# Altium schematic sheet Top Nordic.SchDoc: Top Nordic
size B; CompanyName: Rigado, LLC; SheetNumber: 1; Website: www.rigado.com; SheetSize: B
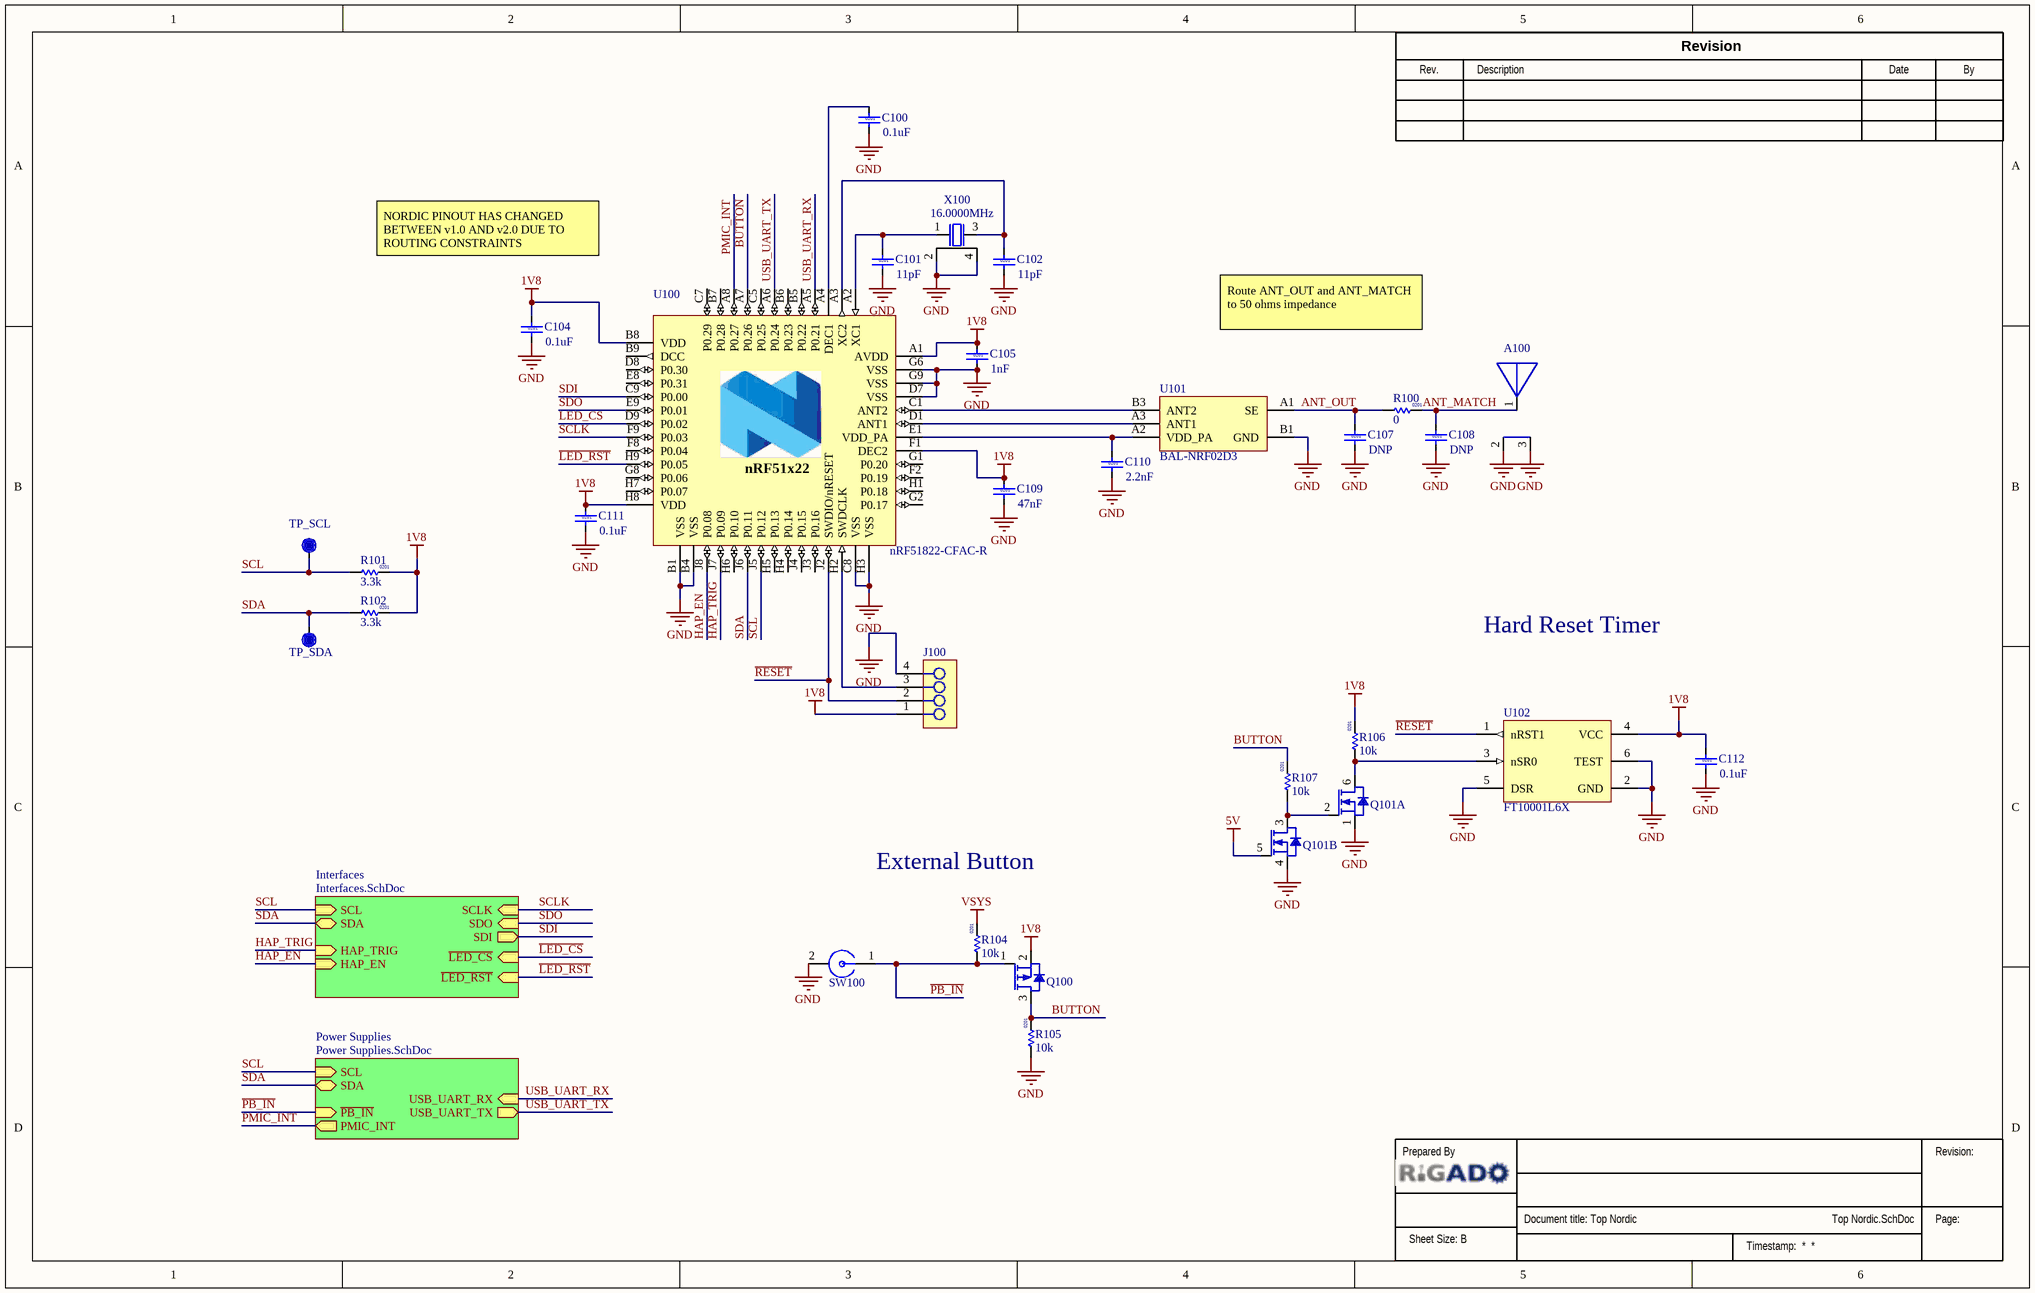
[diagram p0: Top Nordic.SchDoc]

## Parts
(Parts that share a designator on the sheet are numbered #1, #2 ... from top to bottom, then left to right.)
?#1  (no value)  (graphical)
?#2  (no value)  (graphical)
A100  2450AT07A0100  [2450AT07A0100]  (value not drawn)
C100  value 0.1uF  Size: 0201  [Cap 0201 HD]  (hidden comment: Cap 0201 0.1uF 6.3V0.1uF)
C101  value 11pF  Size: 0201  [Cap 0201 HD]  (hidden comment: Cap 0201 11pF 25V11pF)
C102  value 11pF  Size: 0201  [Cap 0201 HD]  (hidden comment: Cap 0201 11pF 25V11pF)
C104  value 0.1uF  Size: 0201  [Cap 0201 HD]  (hidden comment: Cap 0201 0.1uF 6.3V0.1uF)
C105  value 1nF  Size: 0201  [Cap 0201 HD]  (hidden comment: Cap 0201 1nF 25V1nF)
C107  value DNP  Size: 0201  [Cap 0201 HD]  (hidden comment: Cap 0201 GenericDNPDNP)
C108  value DNP  Size: 0201  [Cap 0201 HD]  (hidden comment: Cap 0201 GenericDNPDNP)
C109  value 47nF  Size: 0201  [Cap 0201 HD]  (hidden comment: Cap 0201 47nF 10V47nF)
C110  value 2.2nF  Size: 0201  [Cap 0201 HD]  (hidden comment: Cap 0201 2.2nF 16V2.2nF)
C111  value 0.1uF  Size: 0201  [Cap 0201 HD]  (hidden comment: Cap 0201 0.1uF 6.3V0.1uF)
C112  value 0.1uF  Size: 0201  [Cap 0201 HD]  (hidden comment: Cap 0201 0.1uF 6.3V0.1uF)
J100  SWD_Pogo_TPDNP  [TP10R_1.27P-4Pin]  (value not drawn)
Q100  RZM001P02  [SOT-723]  (value not drawn)
Q101  Si1902CDL  [SC70-6]  (value not drawn)  (parts A,B of 2)
R100  value 0  Size: 0201  [RES 0201 HD]  (hidden comment: Res 0201 0R Jumper0)
R101  value 3.3k  Size: 0201  [RES 0201 HD]  (hidden comment: Res 0201 3.3k 5%3.3k)
R102  value 3.3k  Size: 0201  [RES 0201 HD]  (hidden comment: Res 0201 3.3k 5%3.3k)
R104  value 10k  Size: 0201  [RES 0201 HD]  (hidden comment: Res 0201 10k 5%10k)
R105  value 10k  Size: 0201  [RES 0201 HD]  (hidden comment: Res 0201 10k 5%10k)
R106  value 10k  Size: 0201  [RES 0201 HD]  (hidden comment: Res 0201 10k 5%10k)
R107  value 10k  Size: 0201  [RES 0201 HD]  (hidden comment: Res 0201 10k 5%10k)
SW100  GX05170  [GX05170]  (value not drawn)
TP_SCL  TP  [TP10R]  (value not drawn)
TP_SDA  TP  [TP10R]  (value not drawn)
U100  Manufacturer P/N: nRF51822-CFAC-R  [CFAC_WLCSP]
U101  BAL-NRF02D3  [BGA0.4P2x3-5Pin]
U102  FT10001L6X  [DFN0.5P-6Pin]
X100  Frequency: 16.0000MHz  [XTAL_2016]

## Sub-sheets
Interfaces = Interfaces.SchDoc: SDA (bidir), SCL (in), SDO (in), ~{LED_CS} (in), ~{LED_RST} (in), SCLK (in), HAP_EN (in), HAP_TRIG (in), SDI (out)
Power Supplies = Power Supplies.SchDoc: SCL (in), SDA (bidir), PMIC_INT (out), ~{PB_IN} (in), USB_UART_RX (in), USB_UART_TX (out)

## Nets
1V8: C104.1 C105.1 C109.1 C111.1 C112.1 J100.1 Q100.2(S) R101.2 R102.2 R106.2 U100.A1(AVDD) U100.B8(VDD) U100.F1(DEC2) U100.H8(VDD) U102.4(VCC)
5V: Q101.5(G2)
GND: A100.2 A100.3 C100.2 C101.2 C102.2 C104.2 C105.2 C107.2 C108.2 C109.2 C110.2 C111.2 C112.2 J100.4 Q101.1(S1) Q101.4(S2) R105.1 SW100.2 U100.B1(VSS) U100.B4(VSS) U100.C8(VSS) U100.D7(VSS) U100.G3(N.C.) U100.G4(N.C.) U100.G6(VSS) U100.G9(VSS) U100.H3(VSS) U101.B1(GND) U102.2(GND) U102.5(DSR) U102.6(TEST) X100.2 X100.4
VSYS: R104.2
~{LED_CS}: U100.D9(P0.02) ; sheet Interfaces/~{LED_CS}
~{LED_RST}: U100.H9(P0.05) ; sheet Interfaces/~{LED_RST}
~{PB_IN}: Q100.1(G) R104.1 SW100.1 ; sheet Power Supplies/~{PB_IN}
~{RESET}: J100.2 U100.J2(SWDIO/nRESET) U102.1(nRST1)
ANT_MATCH: A100.1 C108.1 R100.2
ANT_OUT: C107.1 R100.1 U101.A1(SE)
BUTTON: Q100.3(D) R105.2 R107.2 U100.A7(P0.26)
HAP_EN: U100.J8(P0.08) ; sheet Interfaces/HAP_EN
HAP_TRIG: U100.J7(P0.09) ; sheet Interfaces/HAP_TRIG
PMIC_INT: U100.A8(P0.27) ; sheet Power Supplies/PMIC_INT
SCL: R101.1 TP_SCL.1 U100.J5(P0.12) ; sheet Interfaces/SCL, sheet Power Supplies/SCL
SCLK: U100.F9(P0.03) ; sheet Interfaces/SCLK
SDA: R102.1 TP_SDA.1 U100.J6(P0.11) ; sheet Interfaces/SDA, sheet Power Supplies/SDA
SDI: U100.C9(P0.00) ; sheet Interfaces/SDI
SDO: U100.E9(P0.01) ; sheet Interfaces/SDO
USB_UART_RX: U100.A5(P0.21) ; sheet Power Supplies/USB_UART_RX
USB_UART_TX: U100.A6(P0.24) ; sheet Power Supplies/USB_UART_TX
NetC100_1: C100.1 U100.A4(DEC1)
NetC101_1: C101.1 U100.A2(XC1) X100.1
NetC102_1: C102.1 U100.A3(XC2) X100.3
NetC110_1: C110.1 U100.E1(VDD_PA) U101.A2(VDD_PA)
NetJ100_3: J100.3 U100.H2(SWDCLK)
NetQ101_2: Q101.2(G1) Q101.3(D2) R107.1
NetQ101_6: Q101.6(D1) R106.1 U102.3(nSR0)
NetU100_C1: U100.C1(ANT2) U101.B3(ANT2)
NetU100_D1: U100.D1(ANT1) U101.A3(ANT1)

Not connected (* = marked no-connect by the designer): U100 B5(P0.22) B6(P0.23) B7(P0.28) B9(DCC) C5(P0.25) C6(N.C.) C7(P0.29) D8(P0.30) E2(N.C.) E3(N.C.) E7(N.C.) E8(P0.31) F2(P0.19) F3(N.C.) F7(N.C.) F8(P0.04) G1(P0.20) G2(P0.17) G5(N.C.) G7(N.C.) G8(P0.06) H1(P0.18) H4(P0.14) H5(P0.13) H6(P0.10) H7(P0.07) J3(P0.16) J4(P0.15)

## Notes on the sheet
- NORDIC PINOUT HAS CHANGED BETWEEN v1.0 AND v2.0 DUE TO ROUTING CONSTRAINTS
- Route ANT_OUT and ANT_MATCH to 50 ohms impedance
- Hard Reset Timer
- External Button
- Rev.
- Description
- Revision
- Date
- By
- Prepared By
- Revision:
- Page:
- (in symbol nRF51822-CFAC) nRF51x22

## Library data of the parts
?#1 = Top_Revision_Block: Release Revision History Block
?#2 = Top_Title_Block: Top level schematic title block for top level sheet
A100 = 2450AT07A0100: Utra-Minature 2.4GHz Chip antenna, 1.0mm x 0.5mm; Manufacturer: Johanson Technology; Vendor: Digikey; Vendor P/N: 712-1572-1-ND; Added By: Jeremy D; Part Number: 2450AT07A0100; Manufacturer P/N: 2450AT07A0100; Size: 1mmx0.5mm; Height: 0.37mm; Internal Antenna: N/A; RF Freq: 2.4GHz; Added Date: 1/31/2015; Checked Date: 2/5/2015; Checked By: Paul B
C100 C104 C111 C112 = Cap 0201 0.1uF 6.3V: Cap, Ceramic 0.1uF 6.3V 10% X5R  0201; Manufacturer P/N: GRM033R60J104KE19D; Manufacturer: Murata; Manufacturer 2 P/N: C0603X5R0J104K030BC; Vendor: Digikey; Vendor P/N: 490-3167-1-ND; Added By: Jeremy D; Part Number: Cap 0201 0.1uF 6.3V; Tolerance: 10%; Voltage: 6.3V; Manufacturer 2: TDK; Height: 0.33mm; Temp Coefficient: X5R; Added Date: 2/1/2015; Checked By: Cam N; Checked Date: 2/27/2015
C101 C102 = Cap 0201 11pF 25V: Cap, Ceramic 11pF 25V 5% NPO  0201; Manufacturer P/N: CL03C110JA3GNNC; Manufacturer: Samsung; Manufacturer 2 P/N: C0603C0G1E110J030BG; Vendor: Digikey; Vendor P/N: 1276-1386-1-ND; Added By: Jeremy D; Part Number: Cap 0201 11pF 25V; Tolerance: 5%; Voltage: 25V; Manufacturer 2: TDK; Temp Coefficient: NPO; Height: 0.33mm; Added Date: 2/24/2015; Checked By: Cam N; Checked Date: 2/27/2015
C105 = Cap 0201 1nF 25V: Cap, Ceramic 1nF 25V 10% X7R  0201; Manufacturer P/N: GRM033R71E102KA01D; Manufacturer: Murata; Manufacturer 2 P/N: C0603X7R1E102K030BA; Vendor: Digikey; Vendor P/N: 490-3184-1-ND; Added By: Jeremy D; Part Number: Cap 0201 1nF 25V; Tolerance: 10%; Voltage: 25V; Manufacturer 2: TDK; Temp Coefficient: X7R; Height: 0.33mm; Added Date: 2/24/2015; Checked By: Cam N; Checked Date: 2/27/2015
C107 C108 = Cap 0201 Generic: Capacitor, Ceramic 0201; Added By: Jeremy D; Part Number: Cap 0201 Generic; Height: 0.33mm; DNP: DNP; Added Date: 2/1/2015; Checked By: Paul B; Checked Date: 2/5/2015
C109 = Cap 0201 47nF 10V: Cap, Ceramic 47nF 10V 10% X5R  0201; Manufacturer P/N: LMK063BJ473KP-F; Manufacturer: Taiyo Yuden; Manufacturer 2 P/N: CL03A473KP3NNNC; Vendor: Digikey; Vendor P/N: 587-2242-1-ND; Added By: Jeremy D; Part Number: Cap 0201 47nF 10V; Tolerance: 10%; Voltage: 10V; Manufacturer 2: Samsung; Temp Coefficient: X5R; Height: 0.33mm; Added Date: 2/24/2015; Checked By: Cam N; Checked Date: 2/27/2015
C110 = Cap 0201 2.2nF 16V: Cap, Ceramic 2.2nF 16V 10% X7R  0201; Manufacturer P/N: GRM033R71C222KA88D; Manufacturer: Murata; Manufacturer 2 P/N: C0603X7R1C222K030BA; Vendor: Digikey; Vendor P/N: 490-3190-1-ND; Added By: Jeremy D; Part Number: Cap 0201 2.2nF 16V; Tolerance: 10%; Voltage: 16V; Manufacturer 2: TDK; Temp Coefficient: X7R; Height: 0.33mm; Added Date: 2/24/2015; Checked By: Cam N; Checked Date: 2/27/2015
J100 = SWD_Pogo_TP: Test points for 4-wire Serial Wire Debugger header Pogo Pin harness; Added By: Jeremy D; Part Number: SWD_Pogo_TP; Size: 4.8mm x 1mm; Height: 0; DNP: DNP; Added Date: 2/23/2015; Checked By: Cam N; Checked Date: 2/27/2015
Q100 = RZM001P02: P-MOSFET, 20V 100mA, SOT-723; Manufacturer P/N: RZM001P02T2L; Manufacturer: Rohm; VGS Threshold: -1.0V; Vendor: Digikey; Vendor P/N: RZM001P02T2LCT-ND; Added By: Jeremy D; Part Number: RZM001P02; Size: 1.2mm x 0.8mm; Package: SOT-723; Height: 0.55mm; Voltage Rated: 20V; Idc: 100mA; Type: P-MOSFET; Added Date: 2/22/2015; Checked By: Cam N; Checked Date: 2/27/2015
Q101 = Si1902CDL: Dual N-MOSFET, 20V 1A, SC70-6; Manufacturer P/N: SI1902CDL-T1-GE3; Manufacturer: Vishay; VGS Threshold: 1.5V; Vendor: Mouser; Vendor P/N: 78-SI1902CDL-T1-GE3; Added By: Jeremy D; Part Number: Si1902CDL; Size: 2.4mm x 2.2mm; Package: SC70-6; Height: 1.1mm; Voltage Rated: 20V; Idc: 1A; Type: N-MOSFET; Added Date: 3/3/2015; Checked By: Cam N; Checked Date: 3/3/2015
R100 = Res 0201 0R Jumper: Resistor 0 ohm  1/20W, 0201; Manufacturer P/N: RC0603J000CS; Manufacturer: Samsung; Manufacturer 2 P/N: ERJ-1GN0R00C; Vendor: Digikey; Vendor P/N: 1276-3742-1-ND; Added By: Jeremy D; Part Number: Res 0201 0R Jumper; Manufacturer 2: Panasonic; Height: 0.26mm; Power: 1/20W; Added Date: 2/24/2015; Checked By: Cam N; Checked Date: 2/27/2015
R101 R102 = Res 0201 3.3k 5%: Resistor 3.3k ohm 5% 1/20W, 0201; Manufacturer P/N: RC0603J332CS; Manufacturer: Samsung; Manufacturer 2 P/N: MCR006YRTJ332; Vendor: Digikey; Vendor P/N: 1276-3806-1-ND; Added By: Jeremy D; Part Number: Res 0201 3.3k 5%; Manufacturer 2: Rohm; Tolerance: 5%; Height: 0.26mm; Power: 1/20W; Added Date: 2/24/2015; Checked By: Cam N; Checked Date: 2/27/2015
R104-R107 = Res 0201 10k 5%: Resistor 10k ohm 5% 1/20W 0201; Manufacturer P/N: MCR006YRTJ103; Manufacturer: Rohm; Manufacturer 2 P/N: ERJ-1GEJ103C; Vendor: Digikey; Vendor P/N: RHM10KCCCT-ND; Added By: Jeremy D; Part Number: Res 0201 10k 5%; Manufacturer 2: Panasonic; Tolerance: 5%; Height: 0.26mm; Power: 1/20W; Added Date: 2/1/2015; Checked By: Paul B; Checked Date: 2/5/2015
SW100 = GX05170: Snap Dome, high activation force, 5.3mm dia; Manufacturer: Snaptron; Num Positions: 1; Circuit Type: MOM; Added By: Jeremy D; Part Number: GX05170; Manufacturer P/N: GX05170; Size: 5.3mm dia; Height: 0.254mm; Vendor: Snaptron; Added Date: 2/18/2015; Checked By: Cam N; Checked Date: 2/27/2015
TP_SCL TP_SDA = TP10R: Testpoint, Round 1.0mm Dia; Added By: Jeremy D; Part Number: TP10R; Size: 1.0mm; Height: 0; Added Date: 2/1/2015; Checked By: Paul B; Checked Date: 2/5/2015; DNP: DNP
U100 = nRF51822-CFAC: Multiporotocol Bluetooth low energy/2.4GHz RF System on Chip; Manufacturer: Nordic Semiconductor; MFG Footprint: WLCSP 3.83mm x 3.83 mm; Pin #: 62; Voltage-Rated: 3.6V; Flash: 256kB; RAM: 32kB; Number of Bits: 32; Vendor: Digikey; Vendor P/N: 1490-1041-1-ND; Added By: Jeremy D; Part Number: nRF51822-CFAC; Height: .55mm; Packaging: Tape & Reel; Features: 2.4 GHz Transceiver, ARM Cortex M0 32 bit, ADC, 31 GPIO, Serial Protocols; Added Date: 1/30/2015; Checked By: Paul B; Checked Date: 2/5/2015
U101 = BAL-NRF02D3: Balun, 50 ohm transformer for nRF51x22; Manufacturer: ST Micro; RF Freq: 2.4GHz; Vendor: Digikey; Vendor P/N: 497-14009-1-ND; Added By: Jeremy D; Manufacturer P/N: BAL-NRF02D3; Part Number: BAL-NRF02D3; Size: 1.435mmx.905mm; Height: 0.69mm; Internal Antenna: N/A; Added Date: 1/30/2015; Checked Date: 2/5/2015; Checked By: Paul B
U102 = FT10001L6X: Reset Timer with 10.0sec Fixed Delay and Reset Pulse, 1.65v-5.0v; Manufacturer: Fairchild; MFG Footprint: 6-UFDFN; Controller Interface: Discrete; Added By: Jeremy D; Manufacturer P/N: FT10001L6X; Part Number: FT10001L6X; Height: .55mm; Size: 1.45mm x 1.0mm; Type: Reset Timer; Features: Fixed 10.0sec delay, 530ms Reset Pulse; Supplier 1: Digi-key; Supplier Part Number 1: FT10001L6XCT-ND; Added Date: 3/30/2015
X100 = FA-128 16.0000M: Crystal, 16.0000MHz, 10ppm, 2.0mm x 1.6mm; Manufacturer: EPSON; Manufacturer P/N: FA-128 16.0000MF10Z -ACX; Tolerance: +/- 10ppm; CL: 9pF; Temp Range: -20C to +75C; Vendor: Arrow; Added By: Jeremy D; Part Number: FA-128 16.0000M; Size: 2.0mm x 1.6mm; Height: 0.5mm; Added Date: 1/31/2015; Checked By: Paul B; Checked Date: 2/5/2015